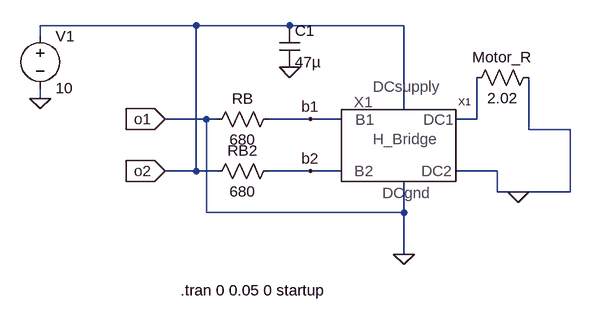
[diagram p0: schematic lab3_a_CurrentLimit_base_R.asc]
lab3_a_CurrentLimit_base_R.asc, the LTspice schematic file:
Version 4
SHEET 1 1484 680
WIRE -80 16 -320 16
WIRE 64 16 -80 16
WIRE 240 16 64 16
WIRE -320 32 -320 16
WIRE -320 128 -320 112
WIRE 240 144 240 16
WIRE -64 160 -128 160
WIRE -48 160 -64 160
WIRE 96 160 32 160
WIRE 144 160 96 160
WIRE 352 160 352 96
WIRE 352 160 320 160
WIRE 432 176 432 96
WIRE 496 176 432 176
WIRE -80 240 -80 16
WIRE -80 240 -128 240
WIRE -48 240 -80 240
WIRE 96 240 32 240
WIRE 144 240 96 240
WIRE 384 240 320 240
WIRE 384 272 384 240
WIRE 416 272 384 272
WIRE 496 272 496 176
WIRE 496 272 416 272
WIRE -64 304 -64 160
WIRE 240 304 240 256
WIRE 240 304 -64 304
WIRE 240 368 240 304
FLAG 240 368 0
FLAG 64 80 0
FLAG -128 240 o2
IOPIN -128 240 In
FLAG -128 160 o1
IOPIN -128 160 In
FLAG -320 128 0
FLAG 96 160 b1
FLAG 96 240 b2
FLAG 416 272 0
SYMBOL res -64 176 R270
WINDOW 0 32 56 VTop 2
WINDOW 3 0 56 VBottom 2
SYMATTR InstName RB
SYMATTR Value 680
SYMBOL res -64 256 R270
WINDOW 0 32 56 VTop 2
WINDOW 3 0 56 VBottom 2
SYMATTR InstName RB2
SYMATTR Value 680
SYMBOL cap 48 16 R0
SYMATTR InstName C1
SYMATTR Value 47µ
SYMBOL LTSpice-Libraries-master\\LTSpice-Libraries-master\\sym\\voltage -320 16 R0
WINDOW 123 0 0 Left 2
WINDOW 39 0 0 Left 2
SYMATTR InstName V1
SYMATTR Value 10
SYMBOL H_bridge1 256 224 R0
SYMATTR InstName X1
SYMBOL res 336 112 R270
WINDOW 0 32 56 VTop 2
WINDOW 3 0 56 VBottom 2
SYMATTR InstName Motor_R
SYMATTR Value 2.02
TEXT -104 424 Left 2 !.tran 0 0.05 0 startup

The netlist it stands for:
* lab3_a_CurrentLimit_base_R.asc
RB 0 b1 680
RB2 o2 b2 680
C1 o2 0 47µ
V1 o2 0 10
XX1 b1 b2 o2 0 N001 0 H_bridge1  ; pins B1 B2 DCSupply DCgnd DC2 DC1
R§Motor_R N001 0 2.02
.tran 0 0.05 0 startup
.backanno
.end

* Results of the author's LTspice run, read from the files saved beside the schematic
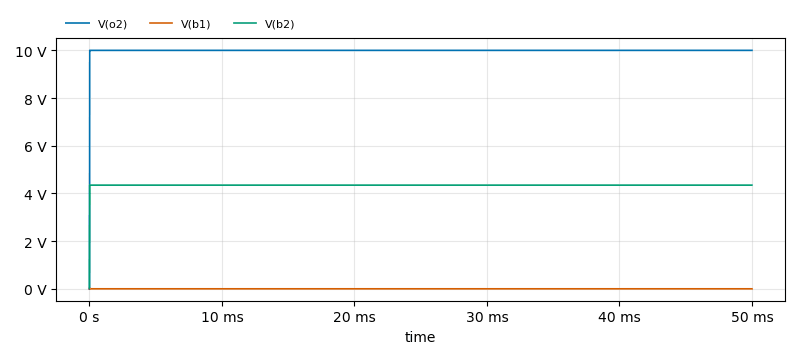
[diagram p1: Transient Analysis of lab3_a_CurrentLimit_base_R.asc, plotted from the saved traces]
* Transient Analysis, 1 run:
*   V(o2): min 0 V, max 10 V, average 9.998 V, rms 9.999 V, last 10 V
*   V(b1): min -426.4 nV, max 44.59 mV, average 13.27 µV, rms 659 µV, last 7.163 nV
*   V(b2): min 0 V, max 4.348 V, average 4.347 V, rms 4.347 V, last 4.348 V